# EAGLE schematic wrist_watch_v1 (EAGLE 6.1)
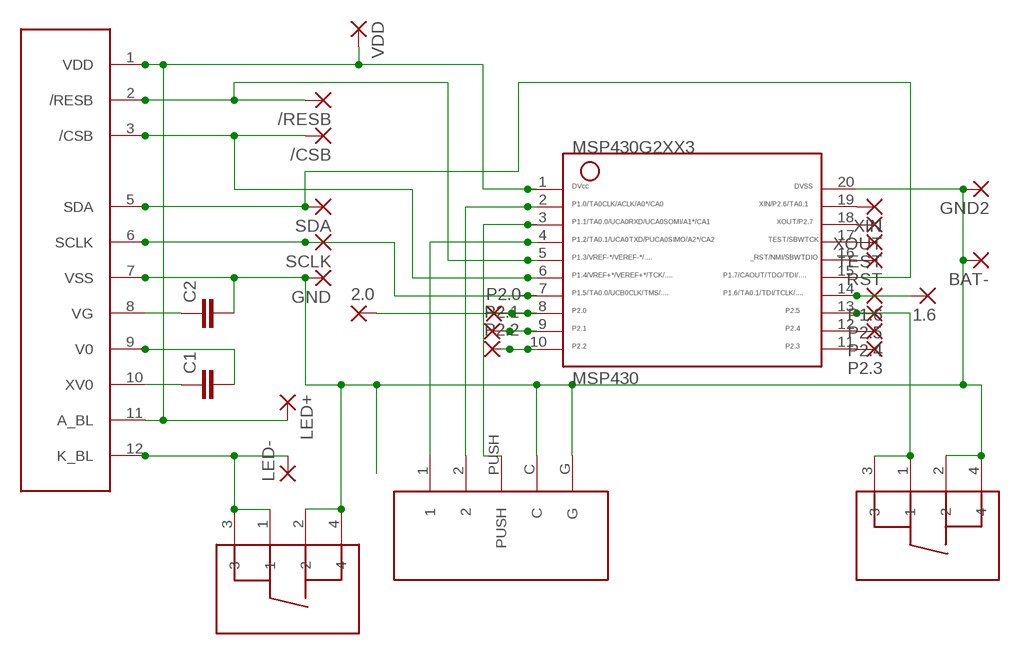
[diagram p0: schematic, sheet 1]

## Parts
1.6  1,6/0,9  [1,6/0,9]
2.0  1,6/0,9  [1,6/0,9]
/CSB  1,6/0,9  [1,6/0,9]
/RESB  1,6/0,9  [1,6/0,9]
BAT-  SMD5  [SMD2,54-5,08]
C1  CAP0805  [0805]
C2  CAP0805  [0805]
GND  1,6/0,9  [1,6/0,9]
GND2  SMD2  [SMD1,27-2,54]
LED+  1,6/0,9  [1,6/0,9]
LED-  1,6/0,9  [1,6/0,9]
MSP430  G2XX3---PW20  [PW20]
P1.6  SMD2  [SMD1,27-2,54]
P2.0  SMD2  [SMD1,27-2,54]
P2.1  SMD2  [SMD1,27-2,54]
P2.2  SMD2  [SMD1,27-2,54]
P2.3  SMD2  [SMD1,27-2,54]
P2.4  SMD2  [SMD1,27-2,54]
P2.5  SMD2  [SMD1,27-2,54]
RST  1,6/0,9  [1,6/0,9]
SCLK  1,6/0,9  [1,6/0,9]
SDA  1,6/0,9  [1,6/0,9]
TEST  1,6/0,9  [1,6/0,9]
U$1  PE9665WRFPE9665WRF-WHOLE  [PE9665WRF]
U$2  MCPTCF-V  [MCPTCF-V]
U$3  MCPL3-BC-V  [MCPL3-BC-V]
U$4  MCPTCF-V  [MCPTCF-V]
VDD  1,6/0,9  [1,6/0,9]
XIN  SMD2  [SMD1,27-2,54]
XOUT  SMD2  [SMD1,27-2,54]

## Nets
C2: C2.1 U$1.8(VG)
GND: BAT-.1(P) C2.2 GND2.1(P) GND.1(P) MSP430.20 U$1.7(VSS) U$2.2 U$2.4 U$3.C U$3.G U$4.2 U$4.4
LED-: LED-.1(P) U$1.12(K_BL) U$2.1 U$2.3
N$1: C1.1 U$1.10(XV0)
N$2: C1.2 U$1.9(V0)
N$3: MSP430.19 XIN.1(P)
N$4: MSP430.3 U$3.PUSH
N$5: MSP430.17 TEST.1(P)
N$6: MSP430.18 XOUT.1(P)
N$7: MSP430.7 SCLK.1(P) U$1.6(SCLK)
N$8: MSP430.15 SDA.1(P) U$1.5(SDA)
N$9: /CSB.1(P) MSP430.6 U$1.3(/CSB)
N$10: /RESB.1(P) MSP430.5 U$1.2(/RESB)
N$11: MSP430.16 RST.1(P)
N$12: MSP430.4 U$3.1
N$13: 1.6.1(P) MSP430.14 P1.6.1(P)
N$14: MSP430.2 U$3.2
N$15: MSP430.13 P2.5.1(P) U$4.1 U$4.3
N$17: MSP430.12 P2.4.1(P)
N$18: MSP430.11 P2.3.1(P)
N$20: MSP430.9 P2.1.1(P)
N$21: MSP430.10 P2.2.1(P)
N$22: 2.0.1(P) MSP430.8 P2.0.1(P)
VDD: LED+.1(P) MSP430.1 U$1.1(VDD) U$1.11(A_BL) VDD.1(P)

## Library data of the parts
1.6 2.0 /CSB /RESB GND LED+ LED- RST SCLK SDA TEST VDD = wirepad:1,6/0,9: THROUGH-HOLE PAD
BAT- = wirepad:SMD5: SMD PAD
C1 C2 = SparkFun-Passives:CAP: Capacitor Standard 0603 ceramic capacitor, and 0.1" leaded capacitor.
GND2 P1.6 P2.0 P2.1-P2.5 XIN XOUT = wirepad:SMD2: SMD PAD
MSP430 = TI_MSP430_v16:G2XX3---PW20: MSP430G2XX1 TSSOP (PW) 20 Pin Package
U$1 = apus-spidisplay:PE9665WRF
U$2 U$4 = apus-spidisplay:MCPTCF-V
U$3 = apus-spidisplay:MCPL3-BC-V